# EAGLE design Monoblink (EAGLE 8.6.0)
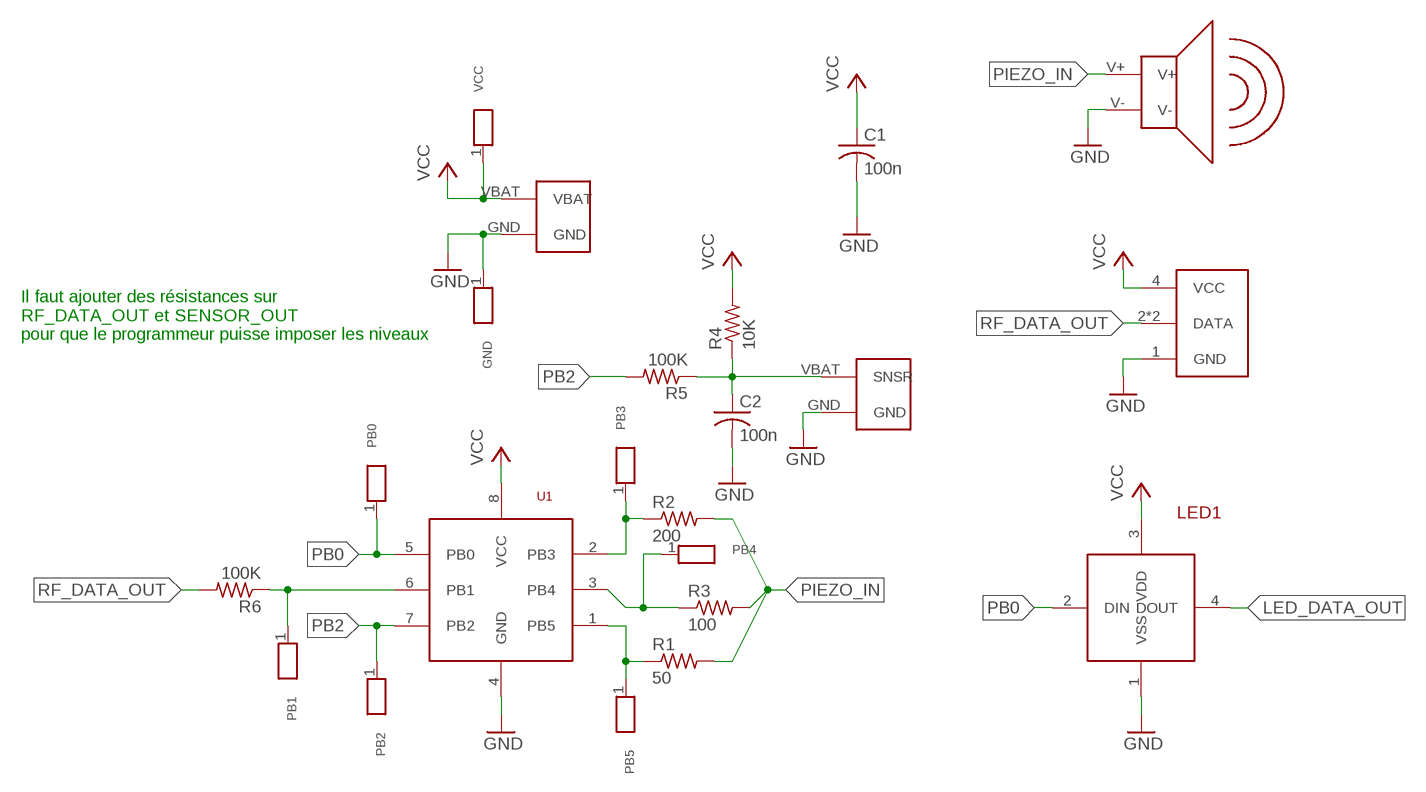
[diagram p0: schematic, sheet 1]

## Parts
C1  100n  C-USC0603  [C0603]
C2  100n  C-USC0603  [C0603]
GND  TESTPAD_PROG_BOARD  [TP2MM]
LED1  NEOPIXEL  [SMD5050]
PB0  TESTPAD_PROG_BOARD  [TP2MM]
PB1  TESTPAD_PROG_BOARD  [TP2MM]
PB2  TESTPAD_PROG_BOARD  [TP2MM]
PB3  TESTPAD_PROG_BOARD  [TP2MM]
PB4  TESTPAD_PROG_BOARD  [TP2MM]
PB5  TESTPAD_PROG_BOARD  [TP2MM]
R1  50  R-US_R0603  [R0603]
R2  200  R-US_R0603  [R0603]
R3  100  R-US_R0603  [R0603]
R4  10K  R-US_R0603  [R0603]
R5  100K  R-US_R0603  [R0603]
R6  100K  R-US_R0603  [R0603]
U1  ATTINY85  [SOIC8]
U$1  RF_CONN  [RF_CONN]
U$2  PIEZO  [PS1240P02BT]
U$3  BATT_TH  [TWO_TH]
U$4  SNSR_CONN  [TWO_TH]
VCC  TESTPAD_PROG_BOARD  [TP2MM]

## Nets
GND: C1.2 C2.2 GND.1 LED1.1(VSS) U1.4(GND) U$1.1(GND) U$2.V- U$3.GND U$4.GND
LED_DATA_OUT: LED1.4(DOUT)
PB0: LED1.2(DIN) PB0.1 U1.5(PB0)
PB1: PB1.1 R6.1 U1.6(PB1)
PB2: PB2.1 R5.2 U1.7(PB2)
PB3: PB3.1 R2.1 U1.2(PB3)
PB4: PB4.1 R3.1 U1.3(PB4)
PB5: PB5.1 R1.1 U1.1(PB5)
PIEZO_IN: R1.2 R2.2 R3.2 U$2.V+
RF_DATA_OUT: R6.2 U$1.2(DATA) U$1.3(DATA)
SENSOR_OUT: C2.1 R4.1 R5.1 U$4.VBAT(SNSR)
VCC: C1.1 LED1.3(VDD) R4.2 U1.8(VCC) U$1.4(VCC) U$3.VBAT VCC.1

## Notes on the sheet
- Il faut ajouter des résistances sur
  RF_DATA_OUT et SENSOR_OUT
  pour que le programmeur puisse imposer les niveaux

## Library data of the parts
C1 C2 = Monoblink:C-US: CAPACITOR, American symbol; SPICEPREFIX: C
GND PB0 PB1-PB5 VCC = Monoblink:TESTPAD_PROG_BOARD: TESTPAD
LED1 = Monoblink:NEOPIXEL
R1-R6 = Monoblink:R-US_: RESISTOR, American symbol; SPICEPREFIX: R
U1 = Monoblink:ATTINY85
U$1 = Monoblink:RF_CONN
U$2 = Monoblink:PIEZO
U$3 = Monoblink:BATT_TH
U$4 = Monoblink:SNSR_CONN

## Board
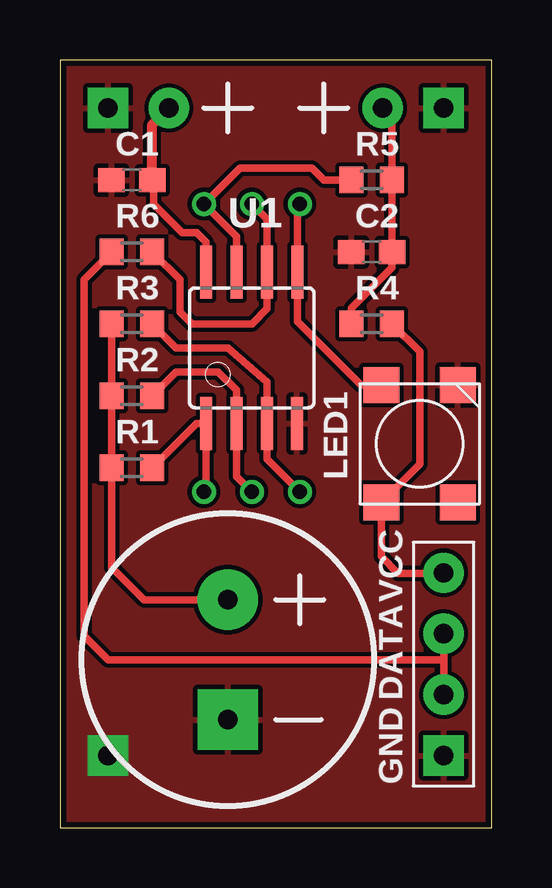
[diagram p1: board, top side]
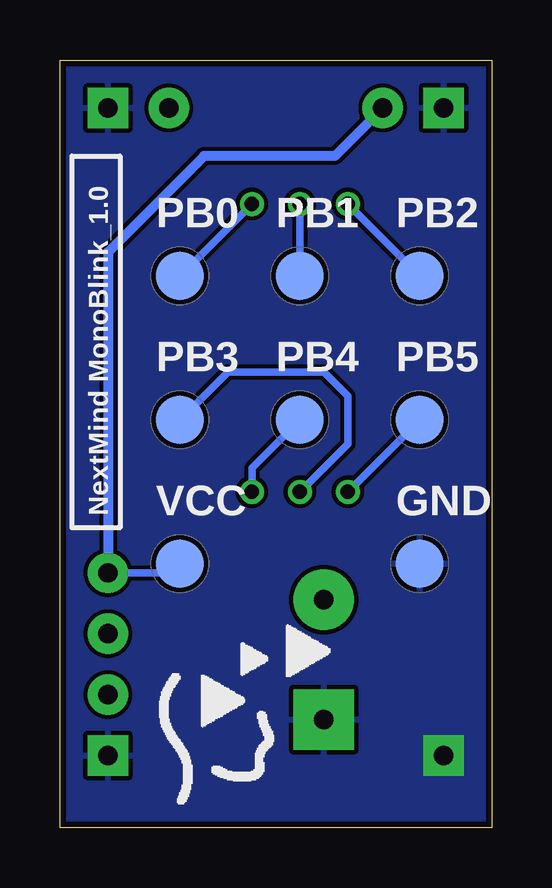
[diagram p2: board, bottom side, seen from below]

Size 18 x 32 mm. Coordinates in mm from the lower left corner, seen from the top.
Outline: 0,0 18,0 18,32 0,32 0,0
Copper layers (1*16): Top 0.018mm / dielectric 1.55mm / Bottom 0.018mm
Design rules "eC_2Layer_PClass5_BaseCopperO18": minimum track width 0.175mm, minimum drill 0.35mm, track to track 0.175mm, track to pad 0.175mm, pad to pad 0.175mm, via to via 0.175mm, smd to smd 0mil, copper to edge 0.25mm, drill to drill 0.35mm, minimum pad ring 0.2mm, minimum via ring 0.15mm, stop-mask expansion 0mil, vias tented up to drill 0.45mm, thermal gap 0.2mm

### Footprints (pad centres in the part's own frame; a part is rotated, then mirrored left to right if it is on the bottom)
C0603 = smd 1.1 x 1: 1 -0.85,0; 2 0.85,0
TP2MM = smd 2 x 2: 1 0,0
SMD5050 = smd 1.5 x 1.5: 1 2.45,-1.6; 2 2.45,1.6; 3 -2.45,1.6; 4 -2.45,-1.6
R0603 = smd 1 x 1.1: 1 -0.85,0; 2 0.85,0
SOIC8 = smd 0.5 x 2.2: 1 -1.905,-3.154; 2 -0.645,-3.154; 3 0.625,-3.154; 4 1.895,-3.154; 5 1.905,3.154; 6 0.635,3.154; 7 -0.635,3.154; 8 -1.905,3.154
RF_CONN = drill 0.8 pad 1.676 square: 1 0,0 | drill 0.8 pad 1.676: 2 0,2.54; 3 0,5.08; 4 0,7.62
PS1240P02BT = drill 0.8 pad 2.54: V+ 0,2.5 | drill 0.8 pad 2.54 square: V- 0,-2.5
TWO_TH = drill 0.8 pad 1.676 square: GND 0,0 | drill 0.8 pad 1.676: VBAT 0,2.54

### Placement (x,y rotation side)
C1  3,27 180 top
C2  13,24 180 top
GND  3,11 0 bottom
LED1  15,16 90 top
PB0  13,23 0 bottom
PB1  8,23 0 bottom
PB2  3,23 0 bottom
PB3  13,17 0 bottom
PB4  8,17 0 bottom
PB5  3,17 0 bottom
R1  3,15 180 top
R2  3,18 180 top
R3  3,21 180 top
R4  13,21 0 top
R5  13,27 180 top
R6  3,24 180 top
U1  8,20 0 top
U$1  16,3 0 top
U$2  7,7 0 top
U$3  2,30 270 top
U$4  16,30 90 top
VCC  13,11 0 bottom

### Tracks (layer width: path | path; a pad name or v marks a point on that pad's centre or on a via)
GND  (via drill 0.8 pad 1.68)
  other vias: 2,3
  pour Top (rank 3): 0,32 18,32 18,0 0,0
  pour Bottom (rank 2): 0,32 18,32 18,0 0,0
PB0  (via drill 0.6 pad 1)
  Top 0.305: U1.5 9.9,25.91 v10,26 | U1.5 10,23.06 | LED1.2 12.55,18.45 9.9,21.09 U1.5
  Bottom 0.305: v10,26 PB0.1
PB1  (via drill 0.6 pad 1)
  Top 0.305: v8,26 8.63,25.36 U1.6 8.63,21.64 8,21 5.5,21 5,21.5 5,22.85 R6.1
  Bottom 0.305: v8,26 PB1.1
PB2  (via drill 0.6 pad 1)
  Top 0.305: U1.7 7.37,24.64 v6,26 7.5,27.5 10.5,27.5 11,27 R5.2
  Bottom 0.305: v6,26 PB2.1
PB3  (via drill 0.6 pad 1)
  Top 0.305: R2.1 4.85,19 6.6,19 7.36,18.25 U1.2 7.36,14.64 v8,14
  Bottom 0.305: v8,14 6,16 6,18 7,19 11,19 PB3.1
PB4  (via drill 0.6 pad 1)
  Top 0.305: v10,14 8.62,15.38 U1.3 8.62,18.57 7,20 4.85,20 R3.1
  Bottom 0.305: v10,14 10,15 PB4.1
PB5  (via drill 0.6 pad 1)
  Top 0.305: R1.1 5.7,16.85 U1.1 6.09,14.1 v6,14
  Bottom 0.305: v6,14 PB5.1
PIEZO_IN
  Top 0.305: R3.2 R2.2 R1.2 2.15,10.85 3.5,9.5 U$2.V+
RF_DATA_OUT
  Top 0.305: U$1.2 16,7 | 16,7 U$1.3 | R6.2 1,22.85 1,8 2,7 16,7
SENSOR_OUT
  Top 0.305: R4.1 12.15,21.65 13.85,23.35 C2.1 R5.1 13.85,29.61 U$4.VBAT
VCC
  Top 0.305: C1.1 3.9,26.95 3.9,26 5.1,24.8 5.7,24.8 6.1,24.4 6.09,24.39 U1.8 | U$1.4 15.98,10.6 14.1,10.6 13.4,11.3 LED1.3 15,15.15 15,19.85 R4.2
  Top 0.406: C1.1 3.85,29.31 U$3.VBAT
  Bottom 0.305: 13.19,10.81 VCC.1 13.38,10.62 U$1.4
  Bottom 0.406: U$3.VBAT 6.54,28 12,28 16,24 U$1.4

### Text on the board
tPlace: VCC | DATA | GND
bPlace: NextMind MonoBlink_1.0